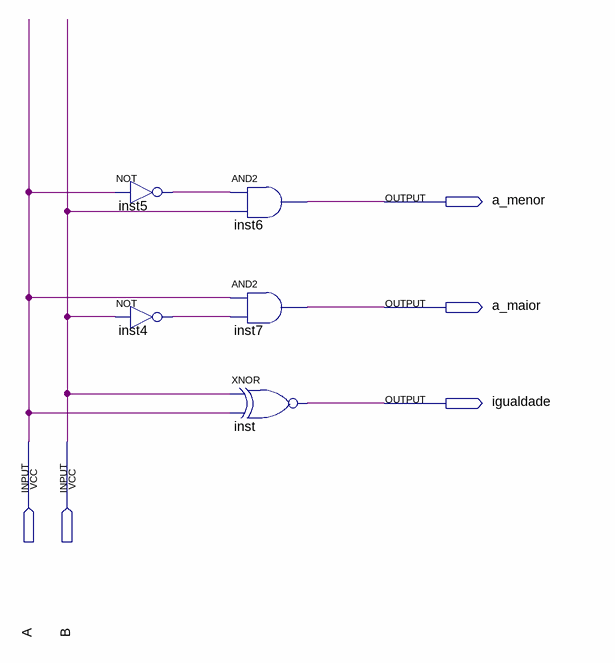
[diagram p0: schematic sheet]
// Quartus schematic half_magnitude.bdf as structural Verilog: 5 symbols, 5 pins
module half_magnitude (
  input  A,
  input  B,
  output a_menor,
  output a_maior,
  output igualdade
);

  wire inst4_out, inst5_out;

  not inst5 (inst5_out, A);
  not inst4 (inst4_out, B);
  and inst6 (a_menor, inst5_out, B);
  and inst7 (a_maior, A, inst4_out);
  xnor inst (igualdade, B, A);
endmodule
